# EasyEDA Pro project ProProject_jlc phxc_2024-02-14.epro

# Schematic jlc phxc
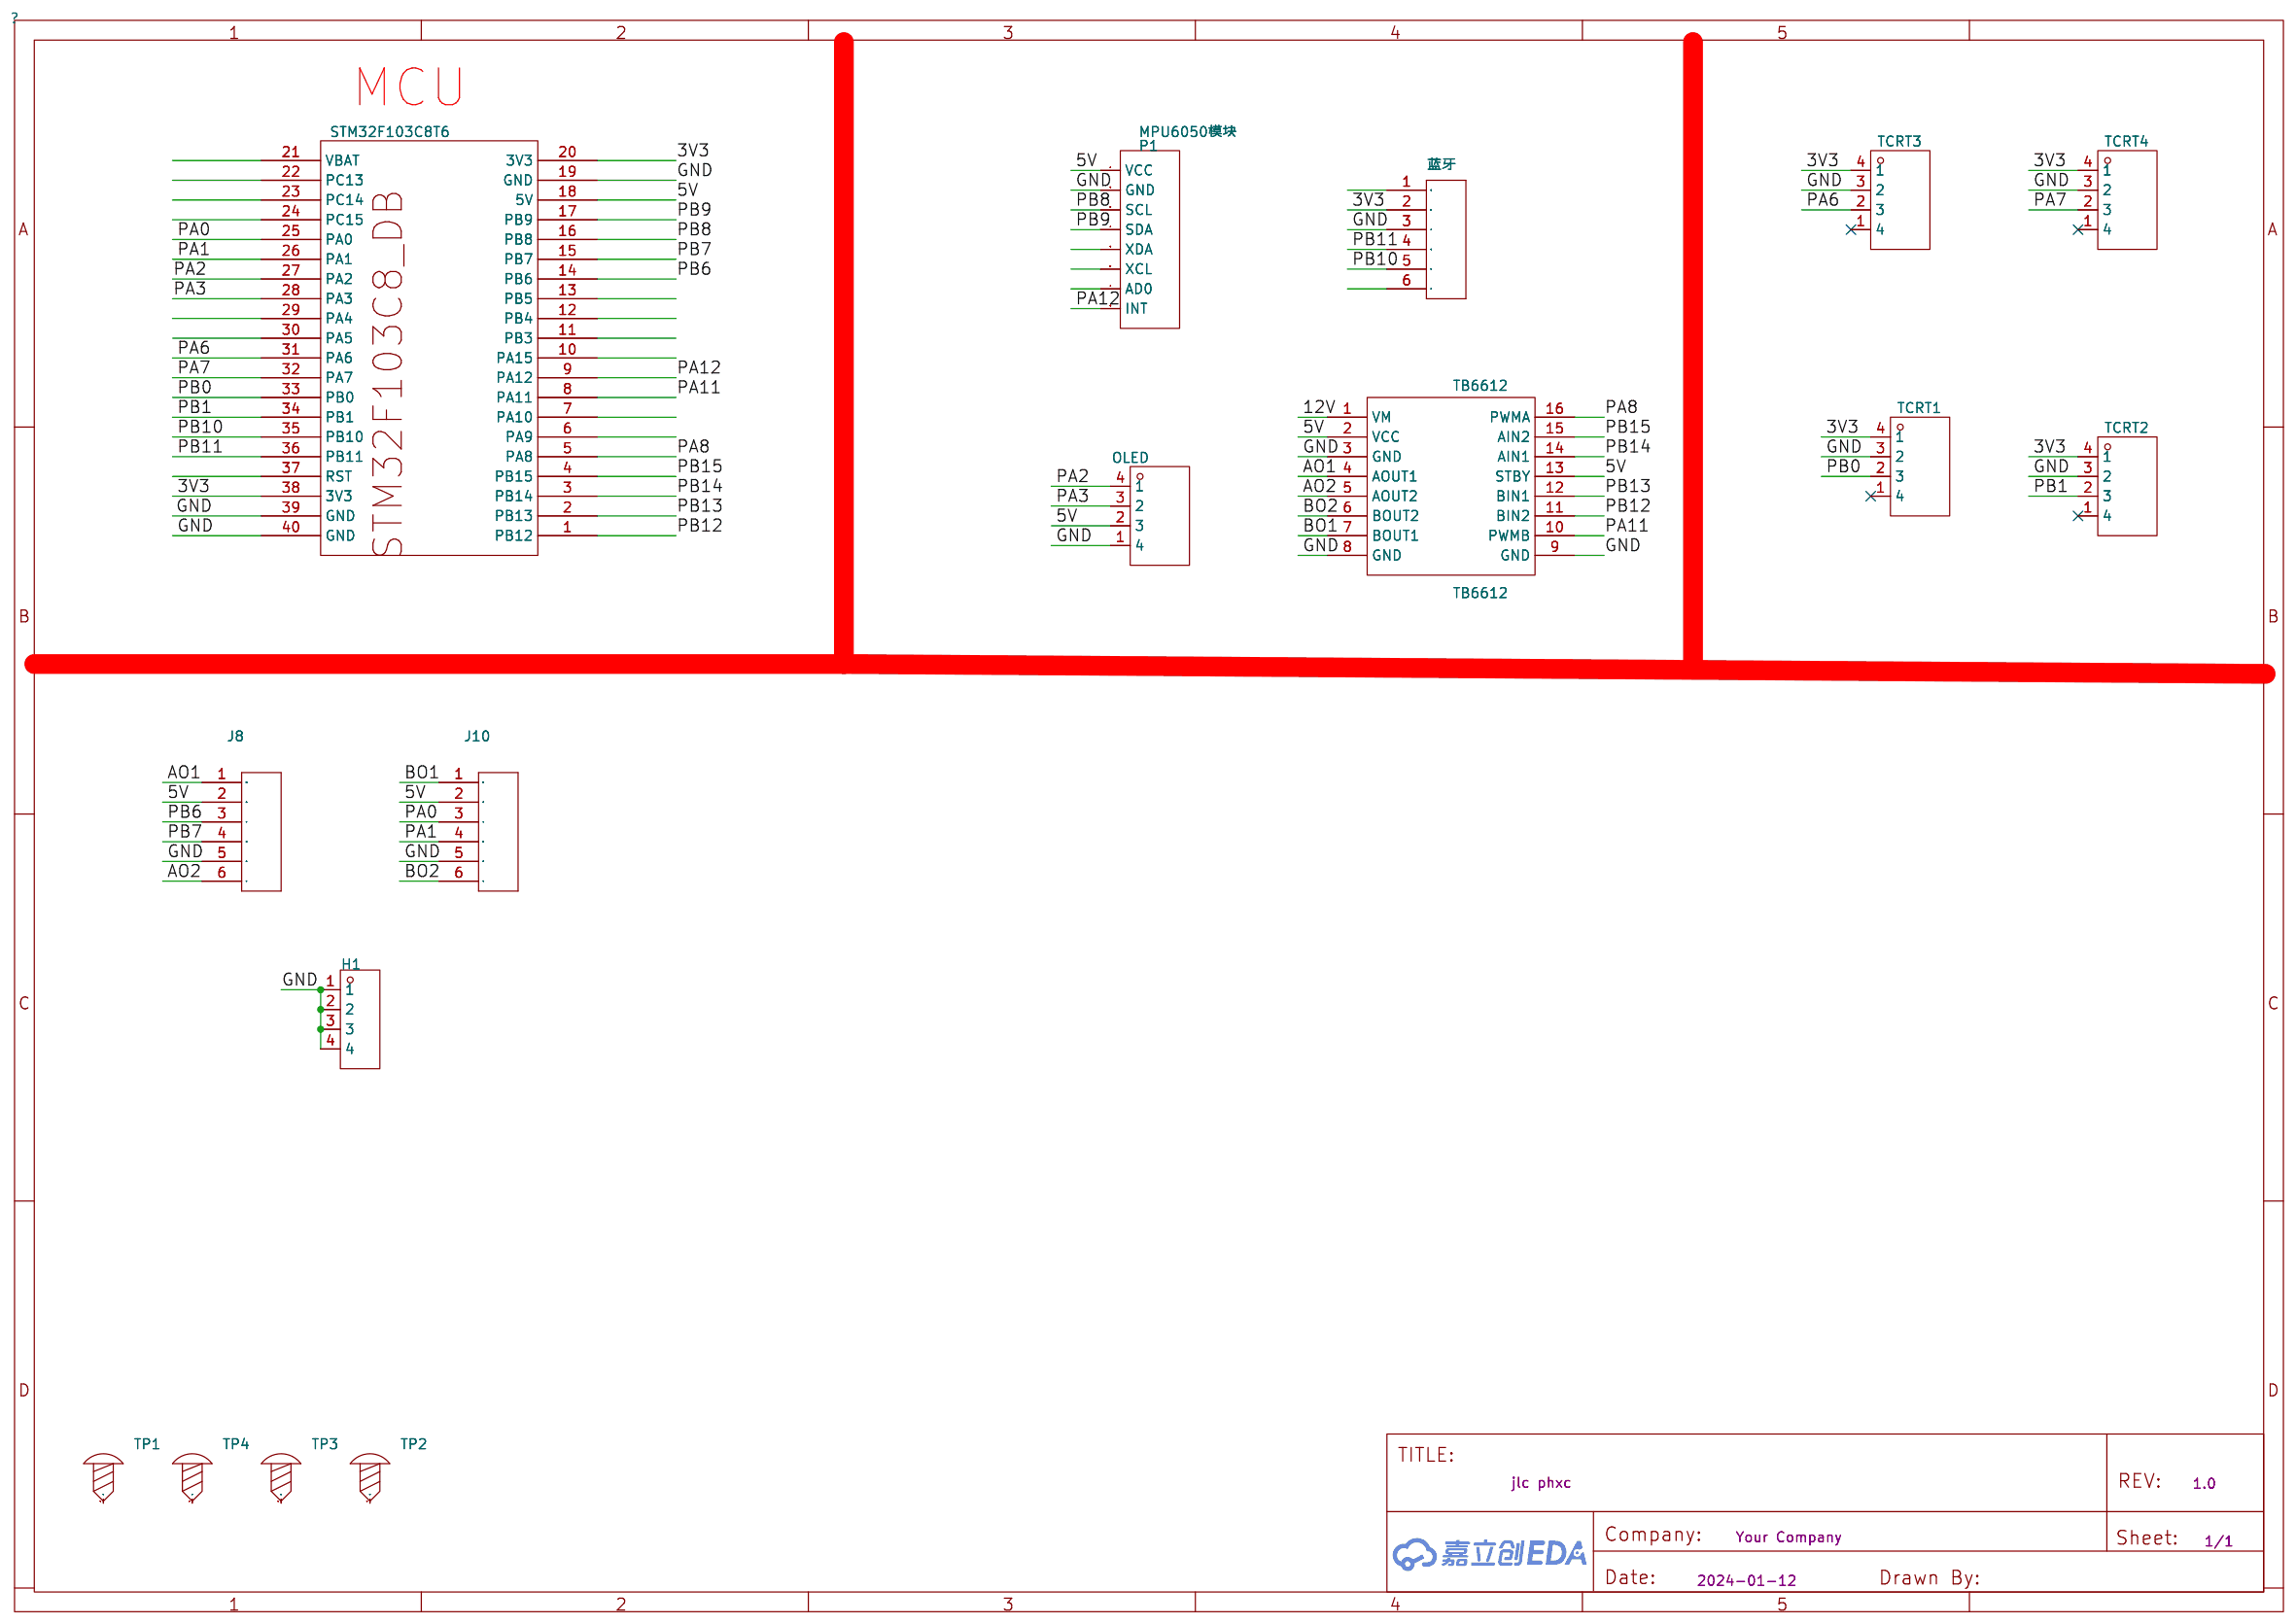
[diagram p0: schematic sheet]

## Parts
1  TCRT1  [TCRT5000-红外循迹模块]
2  TCRT2  [TCRT5000-红外循迹模块]
3  TCRT3  [TCRT5000-红外循迹模块]
4  TCRT4  [TCRT5000-红外循迹模块]
H1  -  [HDR-TH_4P-P2.54-V-F]
J8  F185-1106A1BRYA1  [H6-2.54-90D-FEMALE]
J10  F185-1106A1BRYA1  [H6-2.54-90D-FEMALE]
OLEDU1  OLED  [0.96OLED_4P]
P1  MPU6050模块  [MPU6050模块]
STMSTM32F103C8_DB  STM32F103C8T6  [STM32F103C8T6_DB]
TB6612  TB6612  [COMM-TH_TB6612]
TP1  -  [M3螺丝]
TP2  -  [M3螺丝]
TP3  -  [M3螺丝]
TP4  -  [M3螺丝]
蓝牙  F185-1106A1BRYA1  [H6-2.54-90D-FEMALE]

## Library data of the parts
1 = TCRT1
2 = TCRT2
3 = TCRT3
4 = TCRT4
H1 = HDR-F_2.54_1x4P: Supplier Part: C2718488; Supplier Footprint: 插件
J8 J10 蓝牙 = F185-1106A1BRYA1: DIP Black Female Header R/A;; Supplier: SeeedStudio; Supplier Part: 320030014
OLEDU1 = OLED: link: https://cn.bing.com/search?q=datasheet：0.96OLED
P1 = MPU6050模块
STMSTM32F103C8_DB = STM32F103C8_DB: ComponentLink1Description: DB_hn
TB6612 = TB6612: link: https://cn.bing.com/search?q=datasheet%3A+%20TB6612%E6%A8%A1%E5%9D%97_%E6%AD%A3%E9%9D%A2
TP1-TP4 = M3螺丝: Supplier Footprint: 插件

## Nets
3V3: 1.4(1) 2.4(1) 3.4(1) 4.4(1) STMSTM32F103C8_DB.20(3V3) STMSTM32F103C8_DB.38(3V3) 蓝牙.2(5)
5V: J8.2(5) J10.2(5) OLEDU1.2(3) P1.1(VCC) STMSTM32F103C8_DB.18(5V) TB6612.2(VCC) TB6612.13(STBY)
12V: TB6612.1(VM)
GND: 1.3(2) 2.3(2) 3.3(2) 4.3(2) H1.1 H1.2 H1.3 H1.4 J8.5(2) J10.5(2) OLEDU1.1(4) P1.2(GND) STMSTM32F103C8_DB.19(GND) STMSTM32F103C8_DB.39(GND) STMSTM32F103C8_DB.40(GND) TB6612.3(GND) TB6612.8(GND) TB6612.9(GND) 蓝牙.3(4)
AO1: J8.1(6) TB6612.4(AOUT1)
AO2: J8.6(1) TB6612.5(AOUT2)
BO1: J10.1(6) TB6612.7(BOUT1)
BO2: J10.6(1) TB6612.6(BOUT2)
PA0: J10.3(4) STMSTM32F103C8_DB.25(PA0)
PA1: J10.4(3) STMSTM32F103C8_DB.26(PA1)
PA2: OLEDU1.4(1) STMSTM32F103C8_DB.27(PA2)
PA3: OLEDU1.3(2) STMSTM32F103C8_DB.28(PA3)
PA6: 3.2(3) STMSTM32F103C8_DB.31(PA6)
PA7: 4.2(3) STMSTM32F103C8_DB.32(PA7)
PA8: STMSTM32F103C8_DB.5(PA8) TB6612.16(PWMA)
PA11: STMSTM32F103C8_DB.8(PA11) TB6612.10(PWMB)
PA12: P1.8(INT) STMSTM32F103C8_DB.9(PA12)
PB0: 1.2(3) STMSTM32F103C8_DB.33(PB0)
PB1: 2.2(3) STMSTM32F103C8_DB.34(PB1)
PB6: J8.3(4) STMSTM32F103C8_DB.14(PB6)
PB7: J8.4(3) STMSTM32F103C8_DB.15(PB7)
PB8: P1.3(SCL) STMSTM32F103C8_DB.16(PB8)
PB9: P1.4(SDA) STMSTM32F103C8_DB.17(PB9)
PB10: STMSTM32F103C8_DB.35(PB10) 蓝牙.5(2)
PB11: STMSTM32F103C8_DB.36(PB11) 蓝牙.4(3)
PB12: STMSTM32F103C8_DB.1(PB12) TB6612.11(BIN2)
PB13: STMSTM32F103C8_DB.2(PB13) TB6612.12(BIN1)
PB14: STMSTM32F103C8_DB.3(PB14) TB6612.14(AIN1)
PB15: STMSTM32F103C8_DB.4(PB15) TB6612.15(AIN2)

Not connected (* = marked no-connect by the designer): 1 1(4)*; 2 1(4)*; 3 1(4)*; 4 1(4)*; P1 5(XDA) 6(XCL) 7(AD0); STMSTM32F103C8_DB 6(PA9) 7(PA10) 10(PA15) 11(PB3) 12(PB4) 13(PB5) 21(VBAT) 22(PC13) 23(PC14) 24(PC15) 29(PA4) 30(PA5) 37(RST); TP1 1; TP2 1; TP3 1; TP4 1; 蓝牙 1(6) 6(1)

## Notes on the sheet
- MCU

# Board 1-PCB_PCB_jlc phxc
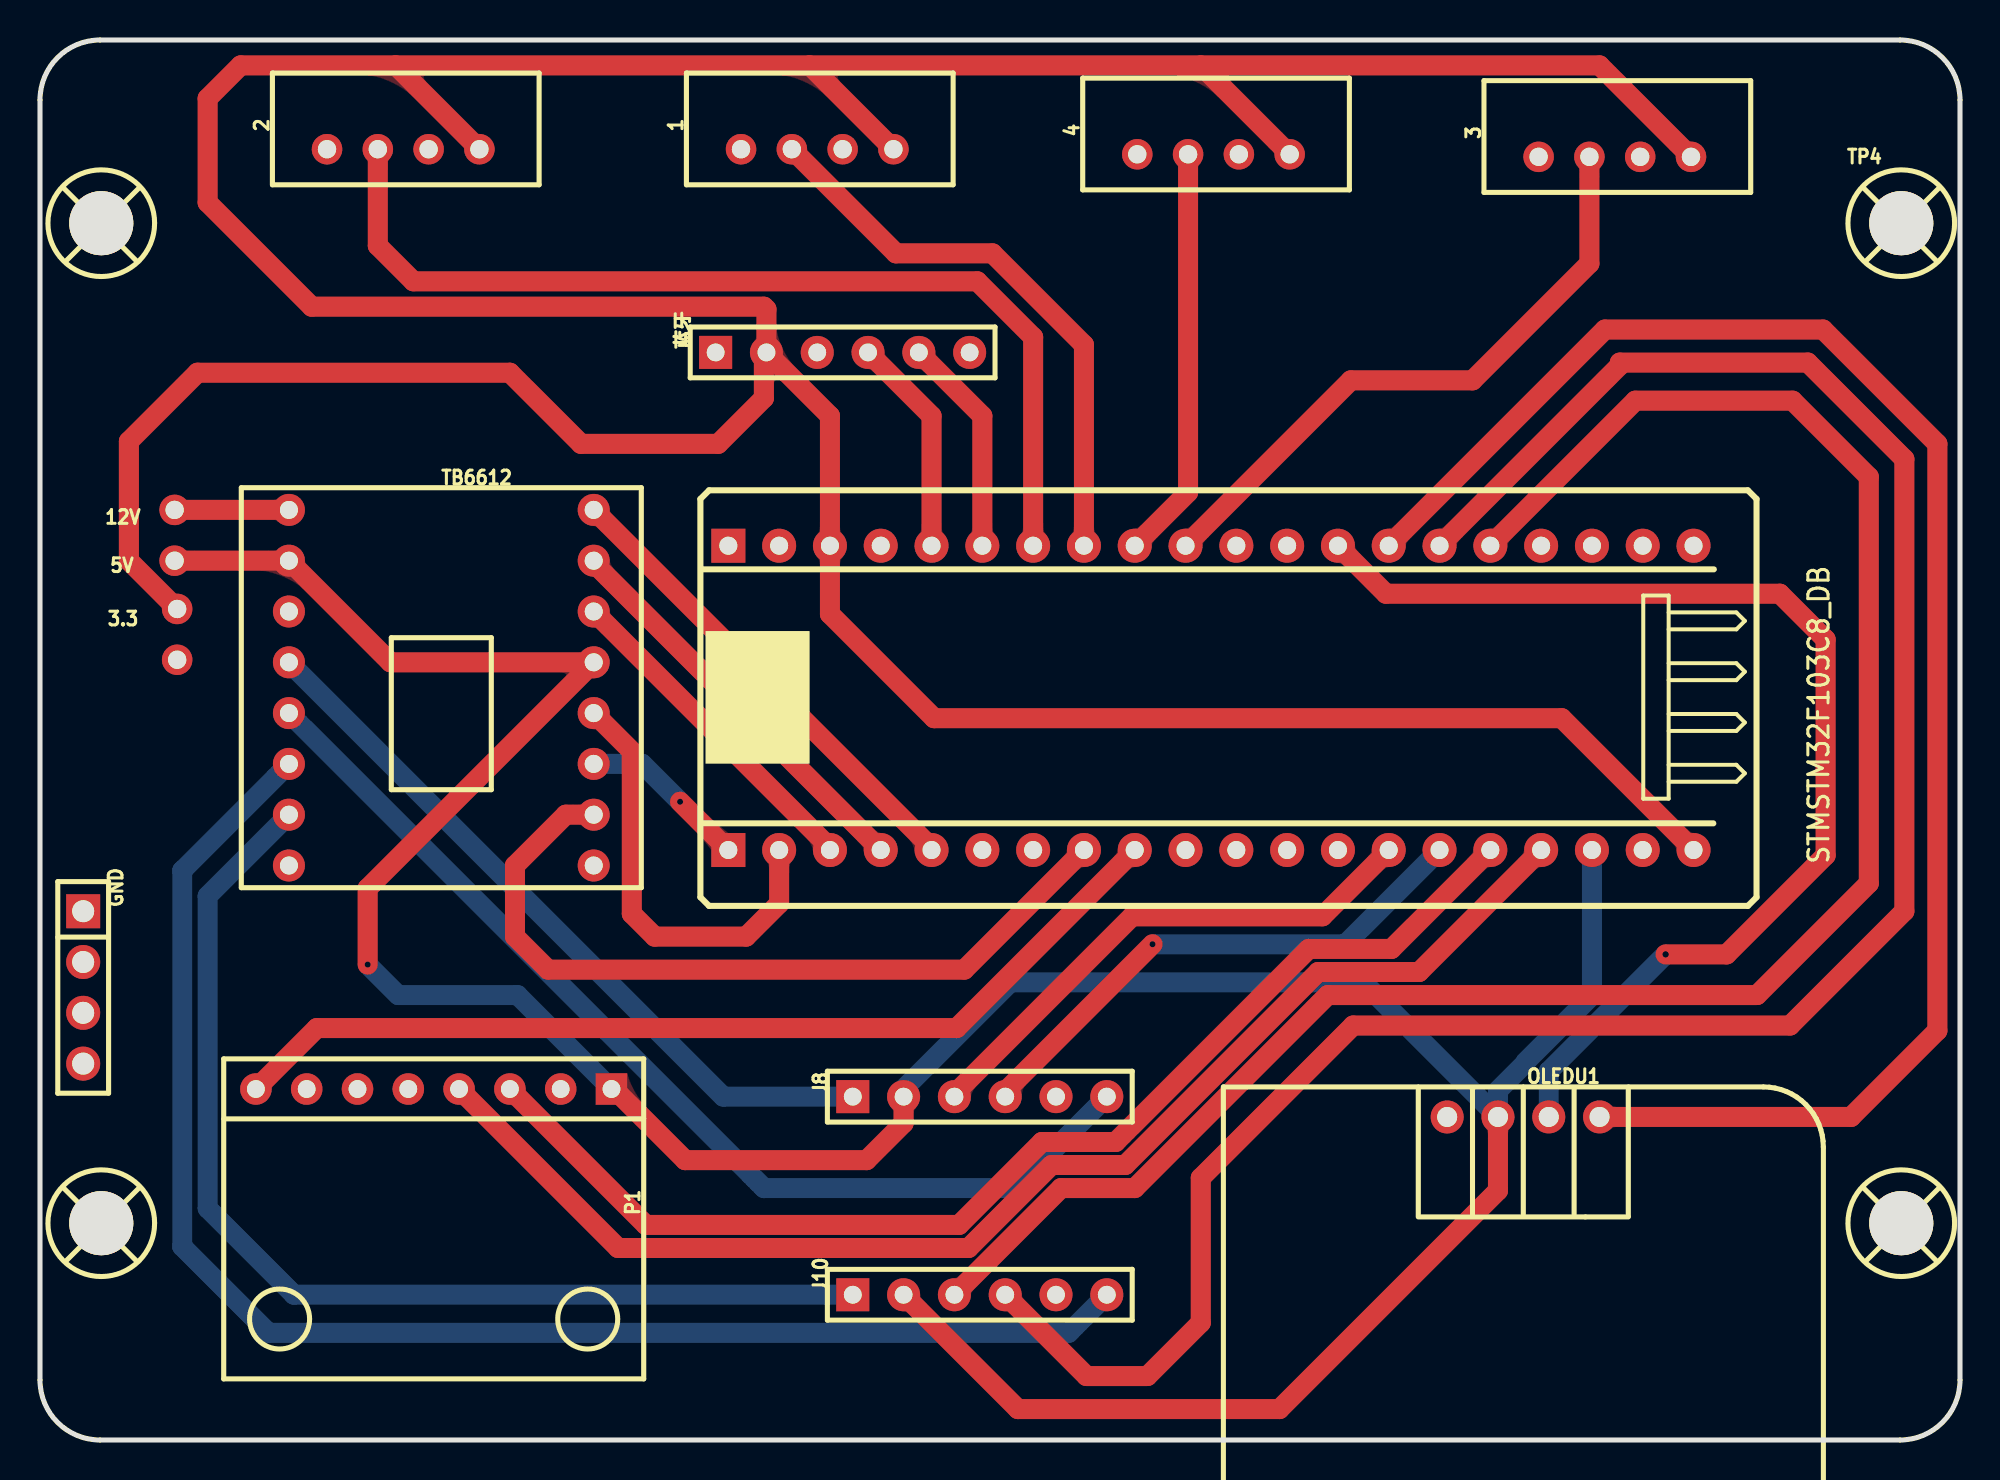
[diagram p1: board, top side]
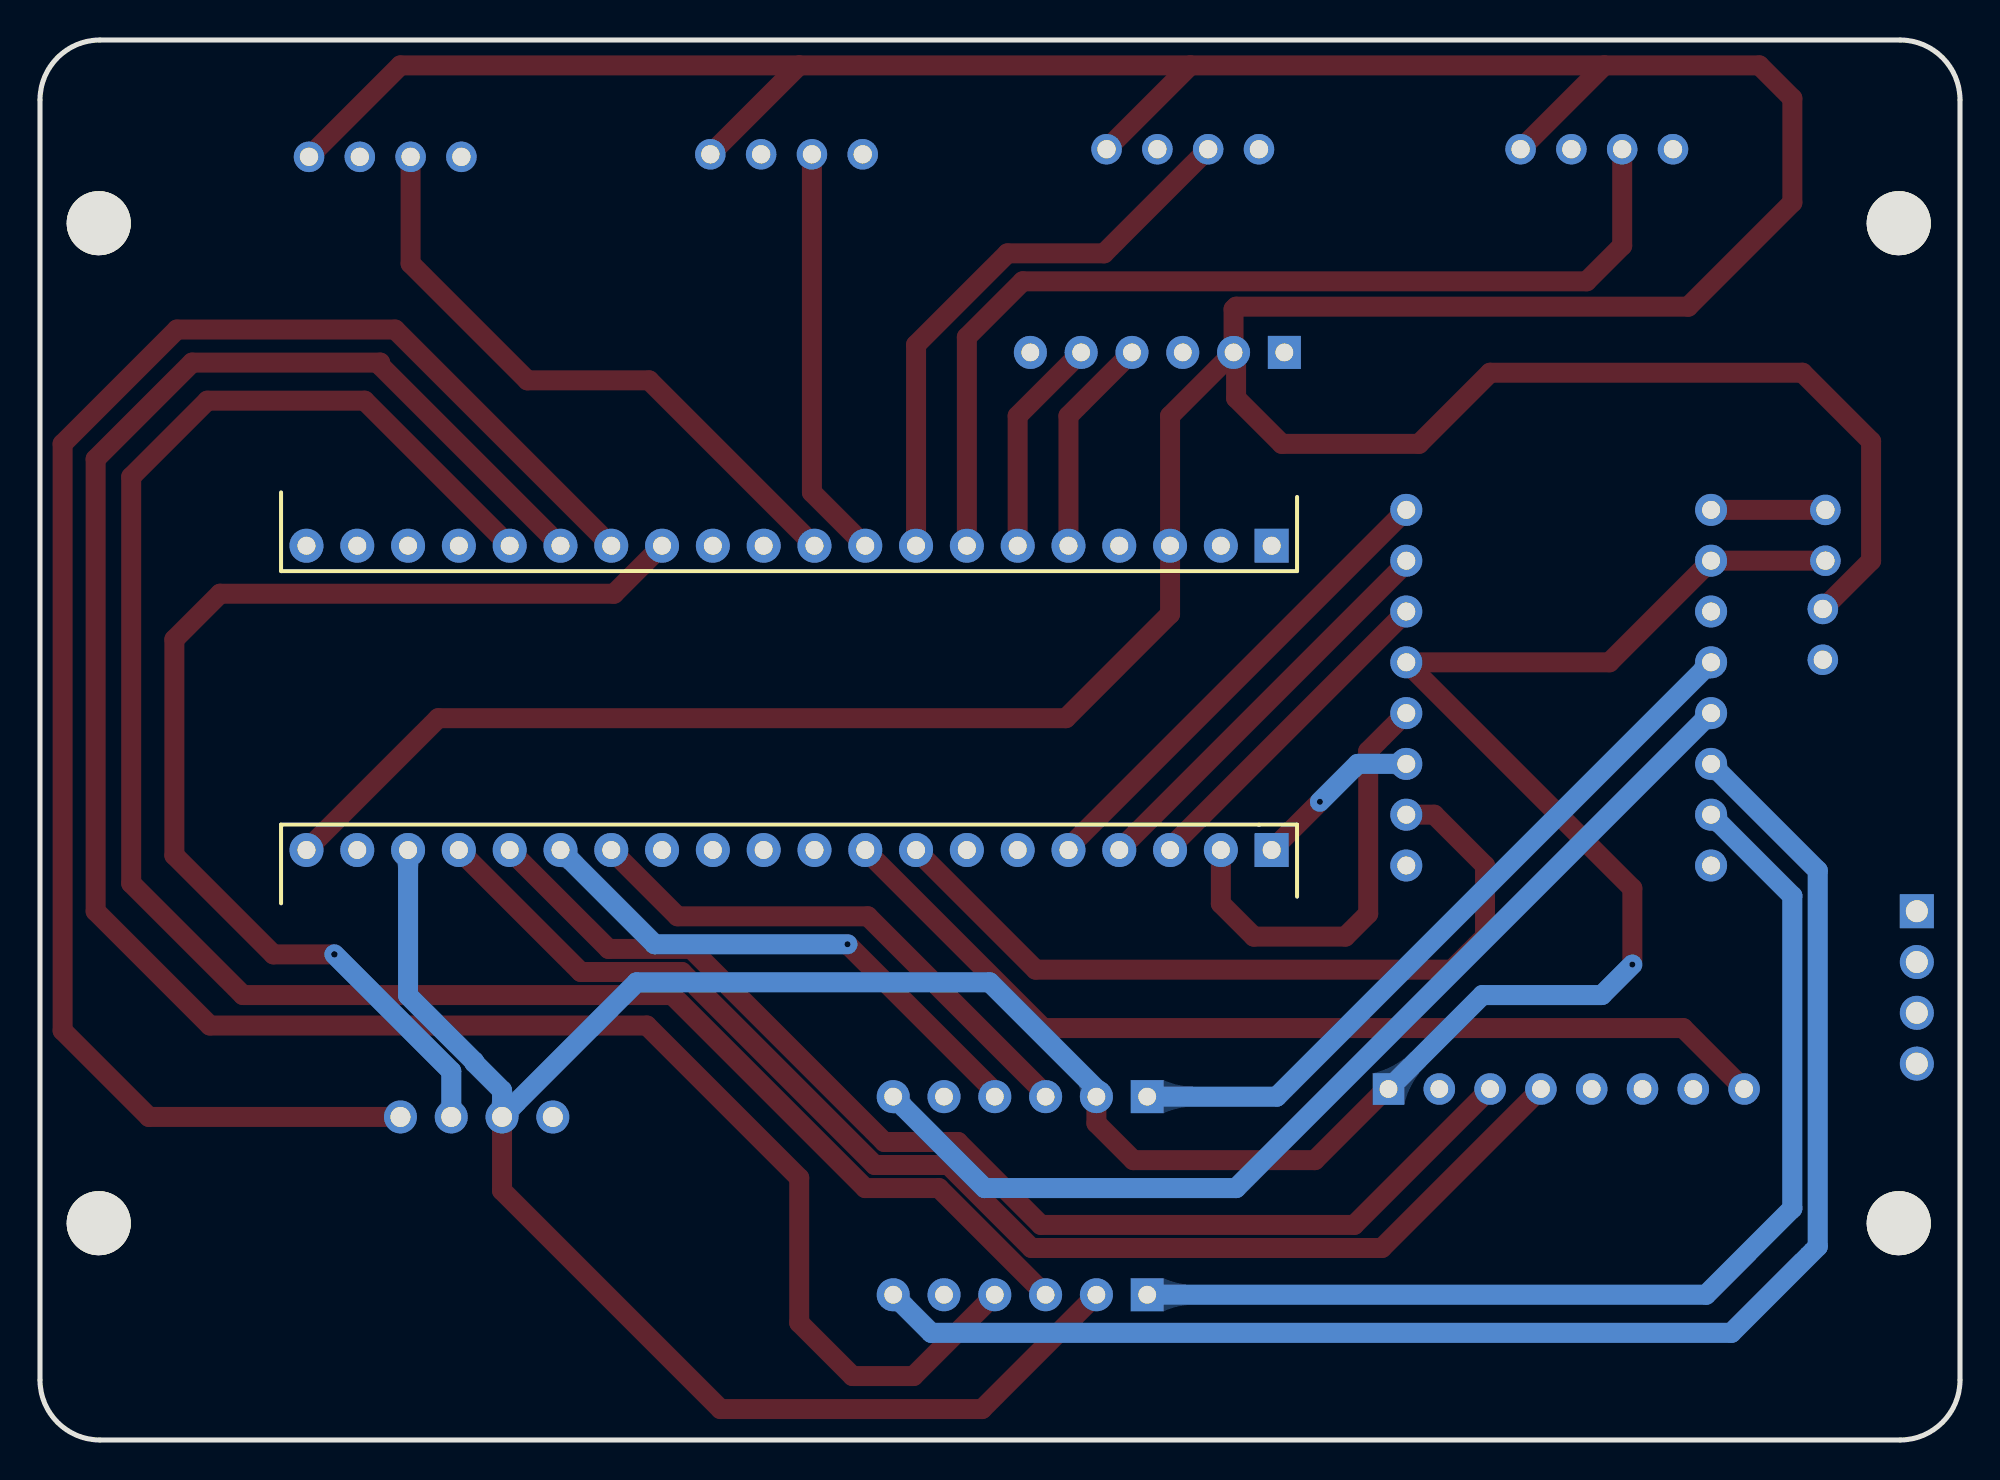
[diagram p2: board, bottom side, seen from below]

Outline 96 x 70 mm; copper layers: Top Layer, Bottom Layer. Coordinates in mm from the lower left corner of the outline.
Outline path: 0,67 0,3 arc(0.88,0.88) 3,0 93,0 arc(95.12,0.88) 96,3 96,67 arc(95.12,69.12) 93,70 3,70 arc(0.88,69.12) 0,67
Stack: Top Layer 0.035mm / Dielectric1 1.51mm FR4 er 4.5 / Bottom Layer 0.035mm

## Design rules (mm)
spacing Default (default): track to track 0.152, other pairs 0 to 0.152
track width Default (default): min 0.254, default 0.254, max 25.4
differential pair differentialPair (default): width min 0.127, default 0.254, max 2.54; gap min 0.152, default 0.152
via Default (default): diameter min 0.61, default 0.61, max 100.025; hole min 0.305, default 0.305, max 59.995
net GND uses gge6083
net 5V uses gge6068

## Placement (name value [footprint] x y rotation side)
1  TCRT1  [TCRT5000-红外循迹模块]  38.86 64.54 90 top
2  TCRT2  [TCRT5000-红外循迹模块]  18.16 64.54 90 top
3  TCRT3  [TCRT5000-红外循迹模块]  78.74 64.16 90 top
3.3  -  [M3螺丝]  93.13 10.78 0 top
4  TCRT4  [TCRT5000-红外循迹模块]  58.67 64.28 90 top
5V  -  [M3螺丝]  3.13 60.78 0 top
12V  -  [M3螺丝]  3.13 10.78 0 top
GND  -  [HDR-TH_4P-P2.54-V-F]  2.16 22.63 270 top
J8  F185-1106A1BRYA1  [H6-2.54-90D-FEMALE]  46.99 17.17 90 top
J10  F185-1106A1BRYA1  [H6-2.54-90D-FEMALE]  46.99 7.26 90 top
NOREF  -  [Pad_e281]  6.73 43.97 0 top
NOREF#2  -  [Pad_e282]  6.86 39.01 0 top
NOREF#3  -  [Pad_e283]  6.86 41.55 0 top
NOREF#4  -  [Pad_e280]  6.73 46.5 0 top
OLEDU1  OLED  [0.96OLED_4P]  74.17 16.15 0 top
P1  -  [MPU6050模块]  10.8 17.55 270 top
STMSTM32F103C8_DB  STM32F103C8T6  [STM32F103C8T6_DB]  58.55 37.11 0 top
TB6612  TB6612  [COMM-TH_TB6612]  20.07 37.61 0 top
TP4  -  [M3螺丝]  93.13 60.78 0 top
蓝牙  F185-1106A1BRYA1  [H6-2.54-90D-FEMALE]  40.13 54.38 90 top

## Footprints (pads in the part's own frame, mm; a bottom-side part is the same pattern mirrored in y, then rotated)
0.96OLED_4P
  round 1.65 hole 1: 1(-3.81,-0.002) 2(-1.27,0.002) 3(1.27,0.002) 4(3.81,0.002)
COMM-TH_TB6612
  round 1.6 hole 0.9: 1(-7.62,8.89) 2(-7.62,6.35) 3(-7.62,3.81) 4(-7.62,1.27) 5(-7.62,-1.27) 6(-7.62,-3.81) 7(-7.62,-6.35) 8(-7.62,-8.89) 9(7.62,-8.89) 10(7.62,-6.35) 11(7.62,-3.81) 12(7.62,-1.27) 13(7.62,1.27) 14(7.62,3.81) 15(7.62,6.35) 16(7.62,8.89)
H6-2.54-90D-FEMALE
  rect 1.651x1.651 hole 0.889: 1(0,6.35)
  round 1.651 hole 0.889: 2(0,3.81) 3(0,1.27) 4(0,-1.27) 5(0,-3.81) 6(0,-6.35)
HDR-TH_4P-P2.54-V-F
  rect 1.7x1.7 hole 1.1: 1(-3.81,0)
  round 1.7 hole 1.1: 2(-1.27,0) 3(1.27,0) 4(3.81,0)
M3螺丝
  round 3.2 hole 3.2: 1(-0.064,0.064)
MPU6050模块
  rect 1.575x1.575 hole 0.889: 1(0,17.78)
  round 1.575 hole 0.889: 2(0,15.24) 3(0,12.7) 4(0,10.16) 5(0,7.62) 6(0,5.08) 7(0,2.54) 8(0,0)
Pad_e280
  round 1.524 hole 0.914: 12V(0,0)
Pad_e281
  round 1.524 hole 0.914: 2(0,0)
Pad_e282
  round 1.524 hole 0.914: 3(0,0)
Pad_e283
  round 1.524 hole 0.914: 4(0,0)
STM32F103C8T6_DB
  rect 1.7x1.7 hole 0.9: 1(-24.13,-7.607) 40(-24.13,7.607)
  round 1.7 hole 0.9: 2(-21.59,-7.607) 3(-19.05,-7.607) 4(-16.51,-7.607) 5(-13.97,-7.607) 6(-11.43,-7.607) 7(-8.89,-7.607) 8(-6.35,-7.607) 9(-3.81,-7.607) 10(-1.27,-7.607) 11(1.27,-7.607) 12(3.81,-7.607) 13(6.35,-7.607) 14(8.89,-7.607) 15(11.43,-7.607) 16(13.97,-7.607) 17(16.51,-7.607) 18(19.05,-7.607) 19(21.59,-7.607) 20(24.13,-7.607) 21(24.13,7.607) 22(21.59,7.607) 23(19.05,7.607) 24(16.51,7.607) 25(13.97,7.607) 26(11.43,7.607) 27(8.89,7.607) 28(6.35,7.607) 29(3.81,7.607) 30(1.27,7.607) 31(-1.27,7.607) 32(-3.81,7.607) 33(-6.35,7.607) 34(-8.89,7.607) 35(-11.43,7.607) 36(-13.97,7.607) 37(-16.51,7.607) 38(-19.05,7.607) 39(-21.59,7.607)
TCRT5000-红外循迹模块
  round 1.524 hole 0.914: 1(0,3.81) 2(0,1.27) 3(0,-1.27) 4(0,-3.81)

## Nets
As in the schematic, except:
3V3: 1.4 2.4 3.4 4.4 NOREF#3.4 STMSTM32F103C8_DB.20 STMSTM32F103C8_DB.38 蓝牙.2
5V: J8.2 J10.2 NOREF.2 OLEDU1.2 P1.1 STMSTM32F103C8_DB.18 TB6612.2 TB6612.13
12V: NOREF#4.12V TB6612.1
GND: 1.3 2.3 3.3 4.3 GND.1 GND.2 GND.3 GND.4 J8.5 J10.5 NOREF#2.3 OLEDU1.1 P1.2 STMSTM32F103C8_DB.19 STMSTM32F103C8_DB.39 STMSTM32F103C8_DB.40 TB6612.3 TB6612.8 TB6612.9 蓝牙.3

Pads without a net: 1 1; 2 1; 3 1; 3.3 1; 4 1; 5V 1; 12V 1; TP4 1

## Via types
v1: diameter 0.61, hole 0.305, Top Layer to Bottom Layer, 5 vias

## Routing (per net, layer and track width the routed paths; a pad name or vN(x,y) marks a point on that pad's centre or on a via; arc(x,y) is an arc through that point)
3V3: length 242.2
  Top Layer w1: 58.04,68.73 38.48,68.73 ; 58.04,68.73 77.98,68.73 3.4 ; 58.04,68.73 4.4 ; 38.48,68.73 1.4 ; 38.48,68.73 17.78,68.73 ; 蓝牙.2 36.32,56.54 36.19,56.67 13.59,56.67 8.38,61.87 8.38,67.08 10.03,68.73 17.78,68.73 ; 蓝牙.2 39.5,51.2 STMSTM32F103C8_DB.38 39.5,41.3 44.7,36.09 76.09,36.09 STMSTM32F103C8_DB.20 ; 蓝牙.2 36.19,54.25 36.19,52.09 33.91,49.81 27.05,49.81 23.5,53.36 7.87,53.36 4.44,49.93 4.44,43.97 NOREF#3.4 ; 17.78,68.73 2.4
5V: length 166.5
  Top Layer w1: J8.2 43.18,15.84 41.33,13.99 32.26,13.99 28.7,17.55 P1.1 ; v1(16.38,23.77) 16.38,27.58 TB6612.13 17.53,38.89 TB6612.2 NOREF.2 ; OLEDU1.2 72.9,12.47 61.98,1.55 48.9,1.55 J10.2
  Bottom Layer w1: v1(16.38,23.77) 17.91,22.25 23.88,22.25 P1.1 ; J8.2 43.18,17.55 48.51,22.88 66.17,22.88 OLEDU1.2 72.9,17.48 74.29,18.87 74.29,18.92 77.6,22.23 STMSTM32F103C8_DB.18
12V: length 5.7
  Top Layer w1: NOREF#4.12V TB6612.1
AO1: length 37.2
  Bottom Layer w1: J8.1 34.16,17.17 TB6612.4
AO2: length 52.6
  Bottom Layer w1: TB6612.5 36.19,12.6 48.77,12.6 J8.6
BO1: length 55.4
  Bottom Layer w1: J10.1 12.7,7.26 8.38,11.58 8.38,27.2 TB6612.7
BO2: length 75.1
  Bottom Layer w1: J10.6 51.44,5.36 11.43,5.36 7.11,9.68 7.11,28.47 TB6612.6
PA0: length 98.1
  Top Layer w1: STMSTM32F103C8_DB.25 79.77,51.97 87.63,51.97 91.44,48.16 91.44,27.84 85.85,22.25 64.39,22.25 54.74,12.6 51.05,12.6 J10.3
PA1: length 112.2
  Top Layer w1: J10.4 52.32,3.2 55.37,3.2 58.04,5.87 58.04,13.1 65.66,20.72 87.5,20.72 93.22,26.44 93.22,49.05 88.39,53.87 78.99,53.87 78.99,53.73 STMSTM32F103C8_DB.26
PA2: length 82.3
  Top Layer w1: 77.98,16.15 90.55,16.15 94.87,20.47 94.87,49.81 89.15,55.52 78.24,55.52 STMSTM32F103C8_DB.27
PA3: length 57.7
  Top Layer w1: v1(81.28,24.28) 84.33,24.28 89.28,29.23 89.28,40.03 87,42.31 67.3,42.31 STMSTM32F103C8_DB.28
  Bottom Layer w1: OLEDU1.3 75.44,18.44 v1(81.28,24.28)
PA6: length 31.4
  Top Layer w1: STMSTM32F103C8_DB.31 65.54,52.98 71.63,52.98 77.47,58.82 3.2
PA7: length 20.7
  Top Layer w1: 4.2 57.4,47.38 STMSTM32F103C8_DB.32
PA8: length 24
  Top Layer w1: STMSTM32F103C8_DB.5 44.58,29.61 TB6612.16
PA11: length 40.2
  Top Layer w1: TB6612.10 26.29,31.27 23.75,28.72 23.75,25.17 25.4,23.52 46.22,23.52 STMSTM32F103C8_DB.8
PA12: length 48.9
  Top Layer w1: STMSTM32F103C8_DB.9 45.83,20.6 13.84,20.6 P1.8
PB0: length 28.7
  Top Layer w1: STMSTM32F103C8_DB.33 52.2,54.76 47.62,59.33 42.8,59.33 1.2
PB1: length 49.9
  Top Layer w1: 2.2 16.89,59.71 18.67,57.94 46.86,57.94 49.66,55.14 STMSTM32F103C8_DB.34
PB6: length 26.9
  Top Layer w1: J8.3 45.72,17.3 54.61,26.19 64.12,26.19 STMSTM32F103C8_DB.14
PB7: length 27
  Top Layer w1: v1(55.63,24.79) 48.26,17.42 J8.4
  Bottom Layer w1: STMSTM32F103C8_DB.15 65.27,24.79 v1(55.63,24.79)
PB8: length 59.6
  Top Layer w1: P1.3 30.29,10.75 45.95,10.75 50.1,14.9 53.78,14.9 63.43,24.55 67.57,24.55 STMSTM32F103C8_DB.16
PB9: length 65.6
  Top Layer w1: STMSTM32F103C8_DB.17 68.96,23.4 63.91,23.4 54.26,13.75 50.58,13.75 46.43,9.6 28.9,9.6 P1.4
PB10: length 11
  Top Layer w1: 蓝牙.5 47.12,51.2 STMSTM32F103C8_DB.35
PB11: length 11
  Top Layer w1: STMSTM32F103C8_DB.36 44.58,51.2 蓝牙.4
PB12: length 8.5
  Top Layer w1: STMSTM32F103C8_DB.1 v1(32,31.91)
  Bottom Layer w1: v1(32,31.91) 30.11,33.81 TB6612.11
PB13: length 22
  Top Layer w1: TB6612.12 29.59,34.44 29.59,26.31 30.73,25.17 35.31,25.17 36.96,26.82 STMSTM32F103C8_DB.2
PB14: length 16.8
  Top Layer w1: TB6612.14 39.5,29.61 STMSTM32F103C8_DB.3
PB15: length 20.4
  Top Layer w1: TB6612.15 27.69,43.85 STMSTM32F103C8_DB.4

## Copper pours and planes (outline as drawn; the poured copper is in the pictures)
GND on Top Layer: -10.8,81.56 119.13,81.56 119.13,-22.96 -10.8,-22.96
GND on Bottom Layer: -23.62,89.94 137.03,89.94 137.03,-36.93 -23.62,-36.93

Small or netless copper shapes (teardrops, artwork), in the pictures only: 68 on Top Layer, 17 on Bottom Layer
